# EAGLE design de0-orpsoc (EAGLE 6.5.0)
Assembly variants: no-eth
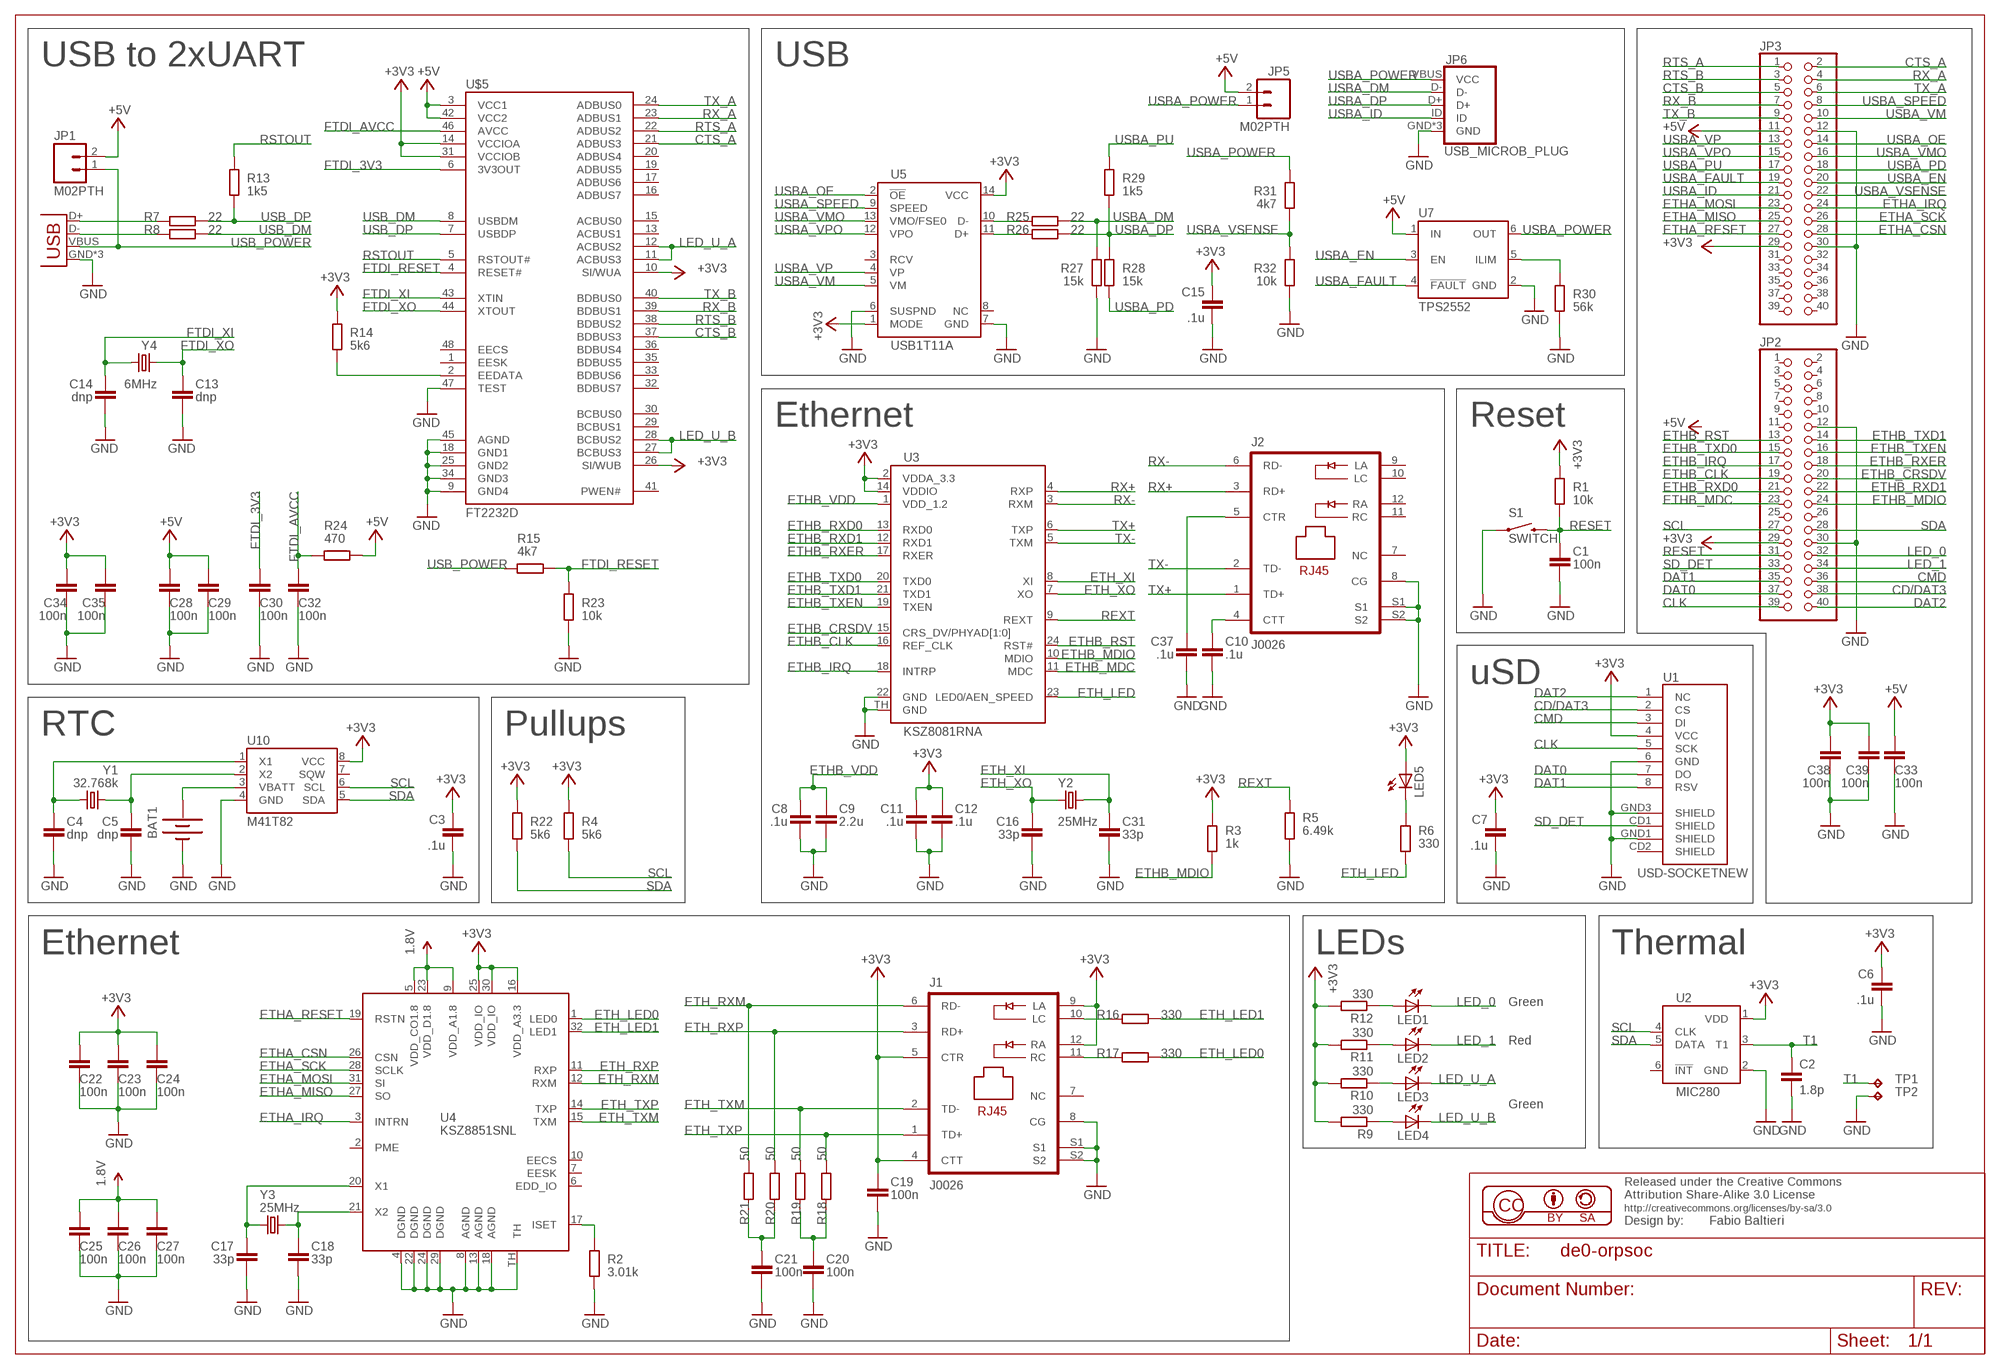
[diagram p0: schematic, sheet 1]

## Parts
BAT1  BATTERY12PTH  [BATTCON_12MM_PTH]
C1  100n  C-EUC0603  [C0603]
C2  1.8p  C-EUC0603  [C0603]
C3  .1u  C-EUC0603  [C0603]
C4  dnp  C-EUC0603  [C0603]
C5  dnp  C-EUC0603  [C0603]
C6  .1u  C-EUC0603  [C0603]
C7  .1u  C-EUC0603  [C0603]
C8  .1u  C-EUC0603  [C0603]
C9  2.2u  C-EUC0603  [C0603]
C10  .1u  C-EUC0603  [C0603]
C11  .1u  C-EUC0603  [C0603]
C12  .1u  C-EUC0603  [C0603]
C13  dnp  C-EUC0603  [C0603]
C14  dnp  C-EUC0603  [C0603]
C15  .1u  C-EUC0603  [C0603]
C16  33p  C-EUC0603  [C0603]
C17  33p  C-EUC0603  [C0603]  (not fitted in variant no-eth)
C18  33p  C-EUC0603  [C0603]  (not fitted in variant no-eth)
C19  100n  C-EUC0603  [C0603]  (not fitted in variant no-eth)
C20  100n  C-EUC0603  [C0603]  (not fitted in variant no-eth)
C21  100n  C-EUC0603  [C0603]  (not fitted in variant no-eth)
C22  100n  C-EUC0603  [C0603]  (not fitted in variant no-eth)
C23  100n  C-EUC0603  [C0603]  (not fitted in variant no-eth)
C24  100n  C-EUC0603  [C0603]  (not fitted in variant no-eth)
C25  100n  C-EUC0603  [C0603]  (not fitted in variant no-eth)
C26  100n  C-EUC0603  [C0603]  (not fitted in variant no-eth)
C27  100n  C-EUC0603  [C0603]  (not fitted in variant no-eth)
C28  100n  C-EUC0603  [C0603]  (not fitted in variant no-eth)
C29  100n  C-EUC0603  [C0603]  (not fitted in variant no-eth)
C30  100n  C-EUC0603  [C0603]
C31  33p  C-EUC0603  [C0603]
C32  100n  C-EUC0603  [C0603]
C33  100n  C-EUC0603  [C0603]  (not fitted in variant no-eth)
C34  100n  C-EUC0603  [C0603]  (not fitted in variant no-eth)
C35  100n  C-EUC0603  [C0603]  (not fitted in variant no-eth)
C37  .1u  C-EUC0603  [C0603]
C38  100n  C-EUC0603  [C0603]  (not fitted in variant no-eth)
C39  100n  C-EUC0603  [C0603]  (not fitted in variant no-eth)
J1  J0026  [PJ-J0]  (not fitted in variant no-eth)
J2  J0026  [PJ-J0]
JP1  M02PTH  [1X02]
JP2  PINHD-2X20  [2X20]
JP3  PINHD-2X20  [2X20]
JP5  M02PTH  [1X02]
JP6  USB_MICROB_PLUG  [USB-MICROB]
JP10  USB-MICROB  [USB-MICROB]
LED1  LEDCHIPLED_0805  [CHIPLED_0805]
LED2  LEDCHIPLED_0805  [CHIPLED_0805]
LED3  LEDCHIPLED_0805  [CHIPLED_0805]
LED4  LEDCHIPLED_0805  [CHIPLED_0805]
LED5  LEDCHIPLED_0805  [CHIPLED_0805]
R1  10k  R-EU_R0603  [R0603]
R2  3.01k  R-EU_R0603  [R0603]  (not fitted in variant no-eth)
R3  1k  R-EU_R0603  [R0603]
R4  5k6  R-EU_R0603  [R0603]
R5  6.49k  R-EU_R0603  [R0603]
R6  330  R-EU_R0603  [R0603]
R7  22  R-EU_R0603  [R0603]
R8  22  R-EU_R0603  [R0603]
R9  330  R-EU_R0603  [R0603]
R10  330  R-EU_R0603  [R0603]
R11  330  R-EU_R0603  [R0603]
R12  330  R-EU_R0603  [R0603]
R13  1k5  R-EU_R0603  [R0603]
R14  5k6  R-EU_R0603  [R0603]
R15  4k7  R-EU_R0603  [R0603]
R16  330  R-EU_R0603  [R0603]  (not fitted in variant no-eth)
R17  330  R-EU_R0603  [R0603]  (not fitted in variant no-eth)
R18  50  R-EU_R0603  [R0603]  (not fitted in variant no-eth)
R19  50  R-EU_R0603  [R0603]  (not fitted in variant no-eth)
R20  50  R-EU_R0603  [R0603]  (not fitted in variant no-eth)
R21  50  R-EU_R0603  [R0603]  (not fitted in variant no-eth)
R22  5k6  R-EU_R0603  [R0603]
R23  10k  R-EU_R0603  [R0603]
R24  470  R-EU_R0603  [R0603]
R25  22  R-EU_R0603  [R0603]
R26  22  R-EU_R0603  [R0603]
R27  15k  R-EU_R0603  [R0603]
R28  15k  R-EU_R0603  [R0603]
R29  1k5  R-EU_R0603  [R0603]
R30  56k  R-EU_R0603  [R0603]
R31  4k7  R-EU_R0603  [R0603]
R32  10k  R-EU_R0603  [R0603]
S1  SWITCH  SWITCH-MOMENTARY-2SMD  [TACTILE_SWITCH_SMD]
TP1  TPTP12R  [TP12R]
TP2  TPTP12R  [TP12R]
U1  USD-SOCKETNEW  [MICRO-SD-SOCKET-PP]
U2  MIC280  [SOT23-6L]
U3  KSZ8081RNA  KSZ8081  [QFN24]
U4  KSZ8851SNL  [MLF32-TH]  (not fitted in variant no-eth)
U5  USB1T11A  [SOIC14]
U7  TPS2552  [SOT23-6L]
U10  M41T82  DS1307SO8  [SO08]
U$5  FT2232D  [LQFP-48]
Y1  32.768k  CRYSTAL32-SMD  [CRYSTAL-32KHZ-SMD]
Y2  25MHz  CRYSTAL5X3  [CRYSTAL-SMD-5X3]
Y3  25MHz  CRYSTAL5X3  [CRYSTAL-SMD-5X3]  (not fitted in variant no-eth)
Y4  6MHz  CRYSTAL5X3  [CRYSTAL-SMD-5X3]

## Nets
1.8V [power]: C25.1 C26.1 C27.1 U4.5(VDD_CO1.8) U4.9(VDD_A1.8) U4.23(VDD_D1.8)
+3V3 [power]: C3.1 C6.1 C7.1 C11.1 C12.1 C15.1 C19.1 C22.1 C23.1 C24.1 C34.1 C35.1 C38.1 C39.1 J1.4(CTT) J1.5(CTR) J1.9(LA) J1.12(RA) JP2.29 JP3.29 LED5.A R1.2 R3.2 R4.1 R9.2 R10.2 R11.2 R12.2 R14.1 R22.1 U1.4(VCC) U2.1(VDD) U3.2(VDDA_3.3) U3.14(VDDIO) U4.16(VDD_A3.3) U4.25(VDD_IO) U4.30(VDD_IO) U5.1(MODE) U5.14(VCC) U10.8(VCC) U$5.10(SI/WUA) U$5.14(VCCIOA) U$5.26(SI/WUB) U$5.31(VCCIOB)
+5V: C28.1 C29.1 C33.1 JP1.2 JP3.11 JP5.2 R24.2 U7.1(IN) U$5.3(VCC1) U$5.42(VCC2)
CD/DAT3: JP2.38 U1.2(CS)
CLK: JP2.39 U1.5(SCK)
CMD: JP2.36 U1.3(DI)
CTS_A: JP3.2 U$5.21(ADBUS3)
CTS_B: JP3.5 U$5.37(BDBUS3)
DAT0: JP2.37 U1.7(DO)
DAT1: JP2.35 U1.8(RSV)
DAT2: JP2.40 U1.1(NC)
ETH_LED: R6.1 U3.23(LED0/AEN_SPEED)
ETH_LED0: R17.2 U4.1(LED0)
ETH_LED1: R16.2 U4.32(LED1)
ETH_RXM: J1.6(RD-) R21.2 U4.12(RXM)
ETH_RXP: J1.3(RD+) R20.2 U4.11(RXP)
ETH_TXM: J1.2(TD-) R19.2 U4.15(TXM)
ETH_TXP: J1.1(TD+) R18.2 U4.14(TXP)
ETH_XI: C31.1 U3.8(XI) Y2.3
ETH_XO: C16.1 U3.7(XO) Y2.1
ETHA_CSN: JP3.28 U4.26(CSN)
ETHA_IRQ: JP3.24 U4.3(INTRN)
ETHA_MISO: JP3.25 U4.27(SO)
ETHA_MOSI: JP3.23 U4.31(SI)
ETHA_RESET: JP3.27 U4.19(RSTN)
ETHA_SCK: JP3.26 U4.28(SCLK)
ETHB_CLK: JP2.19 U3.16(REF_CLK)
ETHB_CRSDV: JP2.20 U3.15(CRS_DV/PHYAD[1:0])
ETHB_IRQ: JP2.17 U3.18(INTRP)
ETHB_MDC: JP2.23 U3.11(MDC)
ETHB_MDIO: JP2.24 R3.1 U3.10(MDIO)
ETHB_RST: JP2.13 U3.24(RST#)
ETHB_RXD0: JP2.21 U3.13(RXD0)
ETHB_RXD1: JP2.22 U3.12(RXD1)
ETHB_RXER: JP2.18 U3.17(RXER)
ETHB_TXD0: JP2.15 U3.20(TXD0)
ETHB_TXD1: JP2.14 U3.21(TXD1)
ETHB_TXEN: JP2.16 U3.19(TXEN)
ETHB_VDD: C8.1 C9.1 U3.1(VDD_1.2)
FTDI_3V3: C30.1 U$5.6(3V3OUT)
FTDI_AVCC: C32.1 R24.1 U$5.46(AVCC)
FTDI_RESET: R15.2 R23.1 U$5.4(RESET#)
FTDI_XI: C14.1 U$5.43(XTIN) Y4.3
FTDI_XO: C13.1 U$5.44(XTOUT) Y4.1
GND: BAT1.GND(-) C1.2 C2.2 C3.2 C4.2 C5.2 C6.2 C7.2 C8.2 C9.2 C10.2 C11.2 C12.2 C13.2 C14.2 C15.2 C16.2 C17.2 C18.2 C19.2 C20.2 C21.2 C22.2 C23.2 C24.2 C25.2 C26.2 C27.2 C28.2 C29.2 C30.2 C31.2 C32.2 C33.2 C34.2 C35.2 C37.2 C38.2 C39.2 J1.8(CG) J1.S1 J1.S2 J2.8(CG) J2.S1 J2.S2 JP2.12 JP2.30 JP3.12 JP3.30 JP6.GND JP6.MT1(GND) JP6.MT2(GND) JP10.GND JP10.MT1(GND) JP10.MT2(GND) R2.2 R5.1 R23.2 R27.2 R30.2 R32.2 S1.1 TP2.TP U1.6(GND) U1.GND1(SHIELD) U1.GND3(SHIELD) U2.2(GND) U3.22(GND) U3.TH(GND) U4.4(DGND) U4.8(AGND) U4.13(AGND) U4.18(AGND) U4.22(DGND) U4.24(DGND) U4.29(DGND) U4.TH U5.6(SUSPND) U5.7(GND) U7.2(GND) U10.4(GND) U$5.9(GND4) U$5.18(GND1) U$5.25(GND2) U$5.34(GND3) U$5.45(AGND) U$5.47(TEST)
LED_0: JP2.32 LED1.C
LED_1: JP2.34 LED2.C
LED_U_A: LED3.C U$5.11(ACBUS3) U$5.12(ACBUS2)
LED_U_B: LED4.C U$5.27(BCBUS3) U$5.28(BCBUS2)
N$1: LED3.A R10.1
N$2: LED4.A R9.1
N$3: C5.1 U10.2(X2) Y1.X1
N$4: BAT1.VCC@1(+) U10.3(VBATT)
N$5: C4.1 U10.1(X1) Y1.X2
N$6: LED5.C R6.2
N$9: JP10.D- R8.1
N$10: C10.1 J2.4(CTT)
N$11: C37.1 J2.5(CTR)
N$12: R25.1 U5.10(D-)
N$13: JP10.D+ R7.1
N$14: R26.1 U5.11(D+)
N$15: R14.2 U$5.2(EEDATA)
N$16: R30.1 U7.5(ILIM)
N$18: LED1.A R12.1
N$19: LED2.A R11.1
N$20: J1.10(LC) R16.1
N$21: J1.11(RC) R17.1
N$22: R2.1 U4.17(ISET)
N$23: C17.1 U4.20(X1) Y3.1
N$24: C18.1 U4.21(X2) Y3.3
N$26: C21.1 R20.1 R21.1
N$27: C20.1 R18.1 R19.1
RESET: C1.1 JP2.31 R1.1 S1.3
REXT: R5.2 U3.9(REXT)
RSTOUT: R13.1 U$5.5(RSTOUT#)
RTS_A: JP3.1 U$5.22(ADBUS2)
RTS_B: JP3.3 U$5.38(BDBUS2)
RX+: J2.3(RD+) U3.4(RXP)
RX-: J2.6(RD-) U3.3(RXM)
RX_A: JP3.4 U$5.23(ADBUS1)
RX_B: JP3.7 U$5.39(BDBUS1)
SCL: JP2.27 R4.2 U2.4(CLK) U10.6(SCL)
SD_DET: JP2.33 U1.CD1(SHIELD)
SDA: JP2.28 R22.2 U2.5(DATA) U10.5(SDA)
T1: C2.1 TP1.TP U2.3(T1)
TX+: J2.1(TD+) U3.6(TXP)
TX-: J2.2(TD-) U3.5(TXM)
TX_A: JP3.6 U$5.24(ADBUS0)
TX_B: JP3.9 U$5.40(BDBUS0)
USB_DM: R8.2 U$5.8(USBDM)
USB_DP: R7.2 R13.2 U$5.7(USBDP)
USB_POWER: JP1.1 JP10.VBUS R15.1
USBA_DM: JP6.D- R25.2 R27.1
USBA_DP: JP6.D+ R26.2 R28.1 R29.2
USBA_EN: JP3.20 U7.3(EN)
USBA_FAULT: JP3.19 U7.4(!FAULT)
USBA_ID: JP3.21 JP6.ID
USBA_OE: JP3.14 U5.2(!OE)
USBA_PD: JP3.18 R28.2
USBA_POWER: JP5.1 JP6.VBUS(VCC) R31.1 U7.6(OUT)
USBA_PU: JP3.17 R29.1
USBA_SPEED: JP3.8 U5.9(SPEED)
USBA_VM: JP3.10 U5.5(VM)
USBA_VMO: JP3.16 U5.13(VMO/FSE0)
USBA_VP: JP3.13 U5.4(VP)
USBA_VPO: JP3.15 U5.12(VPO)
USBA_VSENSE: JP3.22 R31.2 R32.1
Unconnected: J1.7(NC) J2.7(NC) J2.9(LA) J2.10(LC) J2.11(RC) J2.12(RA) JP2.1 JP2.2 JP2.3 JP2.4 JP2.5 JP2.6 JP2.7 JP2.8 JP2.9 JP2.10 JP2.11 JP2.25 JP2.26 JP3.31 JP3.32 JP3.33 JP3.34 JP3.35 JP3.36 JP3.37 JP3.38 JP3.39 JP3.40 U1.CD2(SHIELD) U2.6(!INT) U4.2(PME) U4.6(EDD_IO) U4.7(EESK) U4.10(EECS) U5.3(RCV) U5.8(NC) U10.7(SQW) U$5.1(EESK) U$5.13(ACBUS1) U$5.15(ACBUS0) U$5.16(ADBUS7) U$5.17(ADBUS6) U$5.19(ADBUS5) U$5.20(ADBUS4) U$5.29(BCBUS1) U$5.30(BCBUS0) U$5.32(BDBUS7) U$5.33(BDBUS6) U$5.35(BDBUS5) U$5.36(BDBUS4) U$5.41(PWEN#) U$5.48(EECS)

## Notes on the sheet
- USB to 2xUART | USB
- Ethernet | Reset
- uSD
- RTC | Pullups
- Ethernet | LEDs | Thermal
- Green
- Red
- Green

## Library data of the parts
BAT1 = SparkFun-Electromechanical:BATTERY: Battery Holders Various common sizes : AA, AAA, 20mm coin cell and 12mm coin cell. 20MM_4LEGS, BATT-10373
C1-C35 C37-C39 = rcl:C-EU: CAPACITOR, European symbol
J1 J2 = micrel:J0026: RJ45 PulseJack w/LEDs
JP1 JP5 = SparkFun-Connectors:M02: Standard 2-pin 0.1" header. Use with - straight break away headers ( PRT-00116) - right angle break away headers (PRT-00553) - swiss pins (PRT-00743) - machine pins (PRT-00117) - female headers (PRT-00115) Molex polarized connector foot print use with: PRT-08233 with associated crimp pins and housings. 2.54_SCREWTERM for use with PRT-10571. 3.5mm Screw Terminal footprints for PRT-08084 5mm Screw Terminal footprints for use with PRT-08433
JP2 JP3 = pinhead:PINHD-2X20: PIN HEADER
JP6 = SparkFun-Connectors:USB_MICROB_PLUG: USB Micro-B Plug Comes in a variety of packages. Check out Hirose's ZX-x0 line: http://www.hirose.co.jp/cataloge_hp/e24200011.pdf
JP10 = SparkFun-Connectors:USB: USB Connectors USB-B-PTH is fully proven SKU : PRT-00139/CONN-08278 USB-miniB is fully proven SKU : PRT-00587 USB-A-PCB is untested. USB-A-H is throughly reviewed, but untested. Spark Fun Electronics SKU : PRT-00437 USB-B-SMT is throughly reviewed, but untested. Needs silkscreen touching up. USB-A-S has not been used/tested USB-MB-H has not been used/tested USB-MICROB has been used. CONN-09505; PROD_ID: CONN-09505
LED1-LED5 = led:LED: LED OSRAM: - CHIPLED LG R971, LG N971, LY N971, LG Q971, LY Q971, LO R971, LY R971 LH N974, LH R974 LS Q976, LO Q976, LY Q976 LO Q996 - Hyper CHIPLED LW Q18S LB Q993, LB Q99A, LB R99A - SideLED LS A670, LO A670, LY A670, LG A670, LP A670 LB A673, LV A673, LT A673, LW A673 LH A674 LY A675 LS A676, LA A676, LO A676, LY A676, LW A676 LS A679, LY A679, LG A679 - Hyper Micro SIDELED® LS Y876, LA Y876, LO Y876, LY Y876 LT Y87S - SmartLED LW L88C, LW L88S LB L89C, LB L89S, LG L890 LS L89K, LO L89K, LY L89K LS L896, LA L896, LO L896, LY L896 - TOPLED LS T670, LO T670, LY T670, LG T670, LP T670 LSG T670, LSP T670, LSY T670, LOP T670, LYG T670 LG T671, LOG T671, LSG T671 LB T673, LV T673, LT T673, LW T673 LH T674 LS T676, LA T676, LO T676, LY T676, LB T676, LH T676, LSB T676, LW T676 LB T67C, LV T67C, LT T67C, LS T67K, LO T67K, LY T67K, LW E67C LS E67B, LA E67B, LO E67B, LY E67B, LB E67C, LV E67C, LT E67C LW T67C LS T679, LY T679, LG T679 LS T770, LO T770, LY T770, LG T770, LP T770 LB T773, LV T773, LT T773, LW T773 LH T774 LS E675, LA E675, LY E675, LS T675 LS T776, LA T776, LO T776, LY T776, LB T776 LHGB T686 LT T68C, LB T68C - Hyper Mini TOPLED® LB M676 - Mini TOPLED Santana® LG M470 LS M47K, LO M47K, LY M47K Source: http://www.osram.convergy.de LUXEON: - LUMILED® LXK2-PW12-R00, LXK2-PW12-S00, LXK2-PW14-U00, LXK2-PW14-V00 LXK2-PM12-R00, LXK2-PM12-S00, LXK2-PM14-U00 LXK2-PE12-Q00, LXK2-PE12-R00, LXK2-PE12-S00, LXK2-PE14-T00, LXK2-PE14-U00 LXK2-PB12-K00, LXK2-PB12-L00, LXK2-PB12-M00, LXK2-PB14-N00, LXK2-PB14-P00, LXK2-PB14-Q00 LXK2-PR12-L00, LXK2-PR12-M00, LXK2-PR14-Q00, LXK2-PR14-R00 LXK2-PD12-Q00, LXK2-PD12-R00, LXK2-PD12-S00 LXK2-PH12-R00, LXK2-PH12-S00 LXK2-PL12-P00, LXK2-PL12-Q00, LXK2-PL12-R00 Source: www.luxeon.com KINGBRIGHT: KA-3528ASYC Source: www.kingbright.com
R1-R32 = rcl:R-EU_: RESISTOR, European symbol
S1 = SparkFun-Electromechanical:SWITCH-MOMENTARY-2: Various NO switches- pushbuttons, reed, etc
TP1 TP2 = testpad:TP: Test pad
U1 = SparkFun-Connectors:USD-SOCKET: microSD Socket Push-push type uSD socket. Schematic element and footprint production proven. Spark Fun Electronics SKU : PRT-00127. tDoc lines correctly indicate media card edge positions when inserting (unlocked, locked, depressed).
U2 = balto:MIC280: MIC280 Precision IttyBitty Thermal Supervisor
U3 = balto:KSZ8081: KSZ8081RNA/KSZ8081RND 10Base-T/100Base-TX PHY with RMII Support
U4 = balto:KSZ8851SNL: KSZ8851SNL/SNLI
U5 = balto:USB1T11A: USB1T11A - USB Transceiver
U7 = balto:TPS2552: Precision adjustable current limited power distribution switch
U10 = SparkFun-FreqCtrl:DS1307: I2C real-time clock with battery backup.
U$5 = SparkFun-DigitalIC:FT2232D: USB to USART/FIFO/JTAG/SPI/I2C
Y1 = SparkFun-FreqCtrl:CRYSTAL: Various standard crystals. Proven footprints. Spark Fun Electronics SKU : COM-00534
Y2-Y4 = SparkFun:CRYSTAL: Crystals Various standard crystals. Proven footprints. Spark Fun Electronics SKU : COM-00534

## Net classes
1 power: width 0.203 mm

## Board
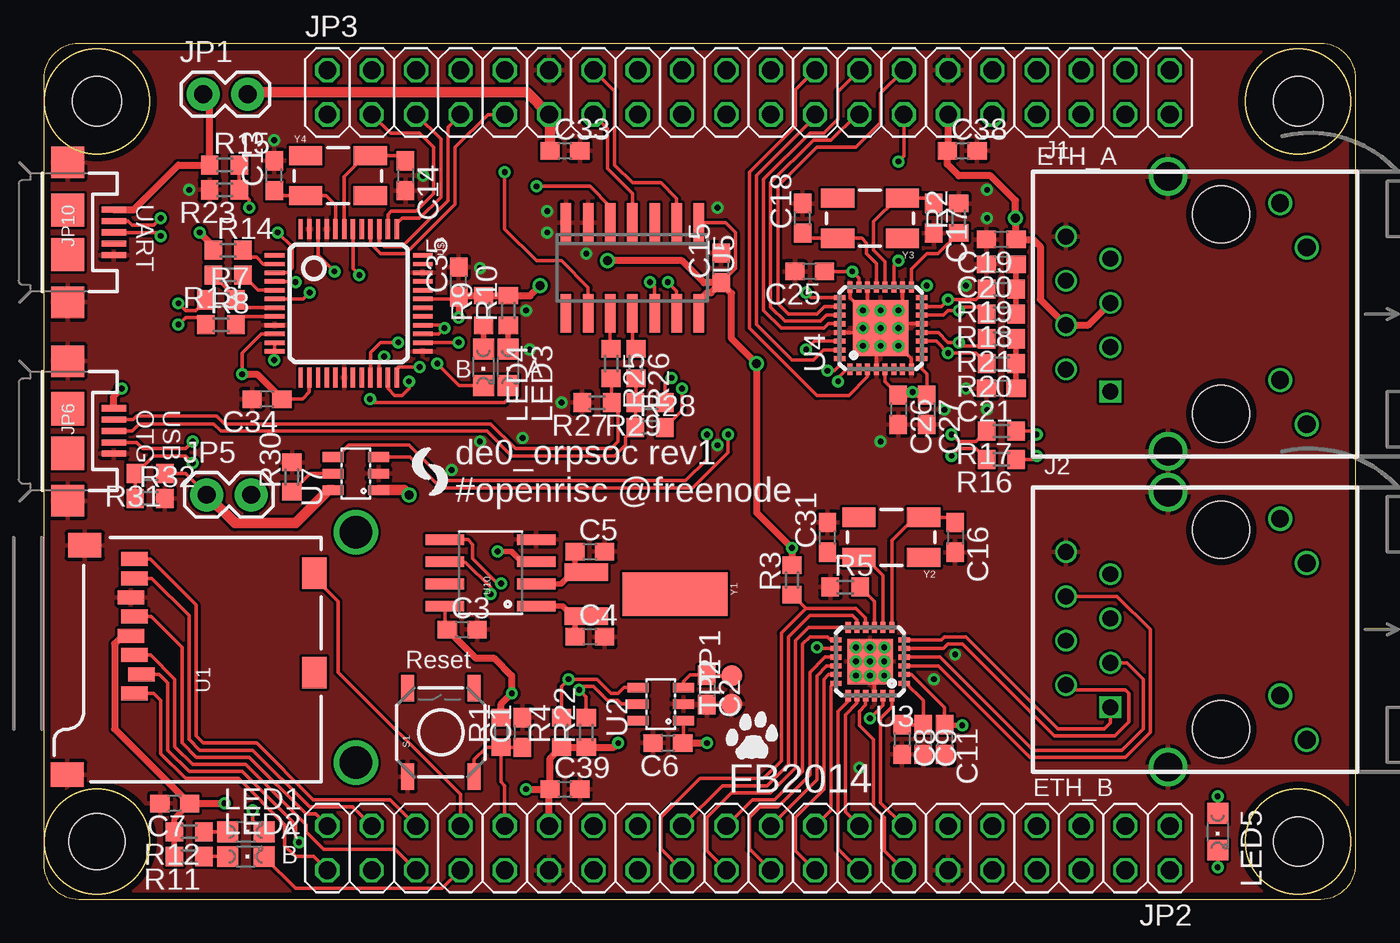
[diagram p1: board, top side]
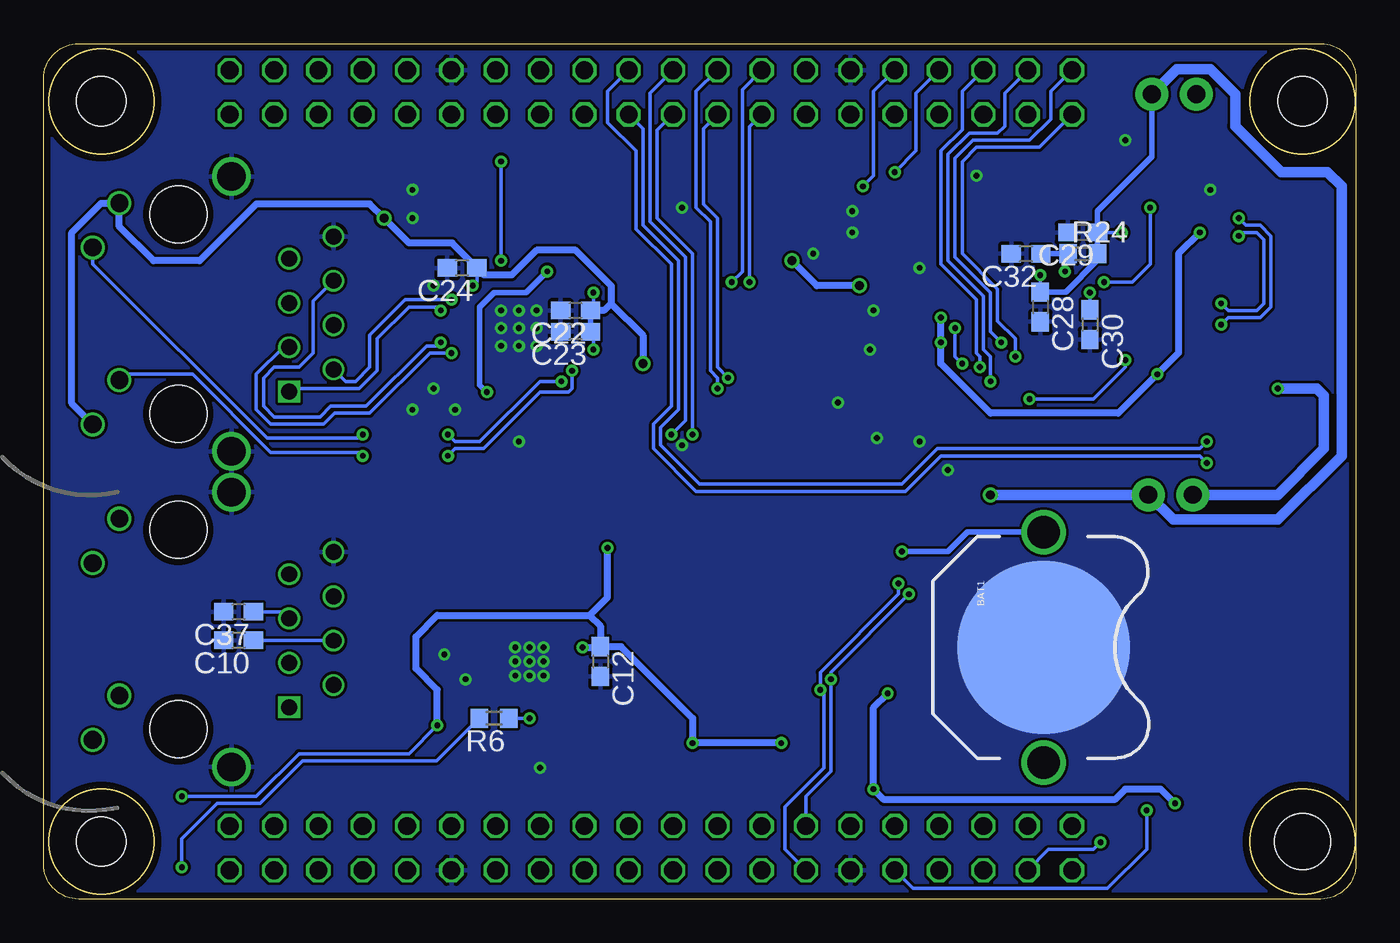
[diagram p2: board, bottom side, seen from below]

Size 75.18 x 49.02 mm. Coordinates in mm from the lower left corner, seen from the top.
Outline: 0,47.02 0,2 arc90 2,0 73.18,0 arc90 75.18,2 75.18,47.02 arc90 73.18,49.02 2,49.02 arc90 0,47.02
Outline: circle at 3.05,3.3 radius 3
Outline: circle at 71.88,3.3 radius 3
Outline: circle at 71.88,45.72 radius 3
Outline: circle at 3.05,45.72 radius 3
Copper layers (1*16): Top 0.035mm / dielectric 1.5mm / Bottom 0.035mm
Design rules "balto *": minimum track width 6mil, minimum drill 13mil, track to track 6mil, track to pad 6mil, pad to pad 6mil, via to via 6mil, smd to smd 6mil, copper to edge 15mil, drill to drill 6mil, minimum pad ring 6mil, minimum via ring 7mil, stop-mask expansion 2mil, vias tented up to drill 20mil, thermal gap 8mil
Holes 3.2 mm at 3.05,3.3
Holes 2.8 mm at 71.88,3.3 71.88,45.72 3.05,45.72

### Footprints (pad centres in the part's own frame; a part is rotated, then mirrored left to right if it is on the bottom)
BATTCON_12MM_PTH = smd 9.906 x 9.906: GND 0,0 | drill 1.854 pad 2.54: VCC@1 -6.604,0; VCC@2 6.604,0
C0603 = smd 1.1 x 1: 1 -0.85,0; 2 0.85,0
PJ-J0 = drill 0.914 square: 1 4.445,-6.35 | drill 0.914: 2 3.175,-8.89; 3 1.905,-6.35; 4 0.635,-8.89; 5 -0.635,-6.35; 6 -1.905,-8.89; 7 -3.175,-6.35; 8 -4.445,-8.89 | drill 1.016: 9 6.325,4.902; 10 3.785,3.378; 11 -3.81,4.902; 12 -6.35,3.378 | drill 1.626: S1 -7.874,-3.048; S2 7.874,-3.048 | hole 3.251: -5.715,0; 5.715,0
1X02 = drill 1.016 pad 1.88: 1 0,0; 2 2.54,0
2X20 = drill 1.016 octagon: 1 -24.13,-1.27; 2 -24.13,1.27; 3 -21.59,-1.27; 4 -21.59,1.27; 5 -19.05,-1.27; 6 -19.05,1.27; 7 -16.51,-1.27; 8 -16.51,1.27; 9 -13.97,-1.27; 10 -13.97,1.27; 11 -11.43,-1.27; 12 -11.43,1.27; 13 -8.89,-1.27; 14 -8.89,1.27; 15 -6.35,-1.27; 16 -6.35,1.27; 17 -3.81,-1.27; 18 -3.81,1.27; 19 -1.27,-1.27; 20 -1.27,1.27; 21 1.27,-1.27; 22 1.27,1.27; 23 3.81,-1.27; 24 3.81,1.27; 25 6.35,-1.27; 26 6.35,1.27; 27 8.89,-1.27; 28 8.89,1.27; 29 11.43,-1.27; 30 11.43,1.27; 31 13.97,-1.27; 32 13.97,1.27; 33 16.51,-1.27; 34 16.51,1.27; 35 19.05,-1.27; 36 19.05,1.27; 37 21.59,-1.27; 38 21.59,1.27; 39 24.13,-1.27; 40 24.13,1.27
USB-MICROB = smd 0.35 x 1.4: D+ 0,2.65; D- -0.65,2.65; GND 1.3,2.65; ID 0.65,2.65; VBUS -1.3,2.65 | smd 1.8 x 1.9: MT1 -4,0; MT2 4,0 | smd 1.9 x 1.9: P$1 -1.27,0; P$2 1.27,0
CHIPLED_0805 = smd 1.2 x 1.2: A 0,-1.05; C 0,1.05
R0603 = smd 1 x 1.1: 1 -0.85,0; 2 0.85,0
TACTILE_SWITCH_SMD = smd 1.524 x 0.762: 1 -2.54,1.905; 2 2.54,1.905; 3 -2.54,-1.905; 4 2.54,-1.905
TP12R = smd 1.2 x 1.2: TP 0,0
MICRO-SD-SOCKET-PP = smd 0.8 x 1.5: 1 -8.94,10.7; 2 -7.84,10.3; 3 -6.74,10.7; 4 -5.64,10.9; 5 -4.54,10.7; 6 -3.44,10.9; 7 -2.34,10.7; 8 -1.24,10.7 | smd 1.8 x 1.4: CD1 -2.05,0.4; CD2 -7.75,0.4 | smd 1.4 x 1.9: GND1 -13.6,14.55; GND3 -0.45,13.55
SOT23-6L = smd 0.55 x 1.2: 1 -0.95,-1.3; 2 0,-1.3; 3 0.95,-1.3; 4 0.95,1.3; 5 0,1.3; 6 -0.95,1.3
QFN24 = smd 0.65 x 0.29: 1 -1.95,1.25; 2 -1.95,0.75; 3 -1.95,0.25; 4 -1.95,-0.25; 5 -1.95,-0.75; 6 -1.95,-1.25; 13 1.95,-1.25; 14 1.95,-0.75; 15 1.95,-0.25; 16 1.95,0.25; 17 1.95,0.75; 18 1.95,1.25 | smd 0.29 x 0.65: 7 -1.25,-1.95; 8 -0.75,-1.95; 9 -0.25,-1.95; 10 0.25,-1.95; 11 0.75,-1.95; 12 1.25,-1.95; 19 1.25,1.95; 20 0.75,1.95; 21 0.25,1.95; 22 -0.25,1.95; 23 -0.75,1.95; 24 -1.25,1.95 | smd 2.6 x 2.6: TH 0,0
MLF32-TH = smd 0.65 x 0.29: 1 -2.35,1.75; 2 -2.35,1.25; 3 -2.35,0.75; 4 -2.35,0.25; 5 -2.35,-0.25; 6 -2.35,-0.75; 7 -2.35,-1.25; 8 -2.35,-1.75; 17 2.35,-1.75; 18 2.35,-1.25; 19 2.35,-0.75; 20 2.35,-0.25; 21 2.35,0.25; 22 2.35,0.75; 23 2.35,1.25; 24 2.35,1.75 | smd 0.29 x 0.65: 9 -1.75,-2.35; 10 -1.25,-2.35; 11 -0.75,-2.35; 12 -0.25,-2.35; 13 0.25,-2.35; 14 0.75,-2.35; 15 1.25,-2.35; 16 1.75,-2.35; 25 1.75,2.35; 26 1.25,2.35; 27 0.75,2.35; 28 0.25,2.35; 29 -0.25,2.35; 30 -0.75,2.35; 31 -1.25,2.35; 32 -1.75,2.35 | smd 3.2 x 3.2: TH 0,0
SOIC14 = smd 0.6 x 2.2: 1 -3.81,-2.6; 2 -2.54,-2.6; 3 -1.27,-2.6; 4 0,-2.6; 5 1.27,-2.6; 6 2.54,-2.6; 7 3.81,-2.6; 8 3.81,2.6; 9 2.54,2.6; 10 1.27,2.6; 11 0,2.6; 12 -1.27,2.6; 13 -2.54,2.6; 14 -3.81,2.6
SO08 = smd 0.61 x 2.21: 1 -1.905,-2.616; 2 -0.635,-2.616; 3 0.635,-2.616; 4 1.905,-2.616; 5 1.905,2.616; 6 0.635,2.616; 7 -0.635,2.616; 8 -1.905,2.616
LQFP-48 = smd 0.254 x 1.143: 1 -2.75,-4.25; 2 -2.25,-4.25; 3 -1.75,-4.25; 4 -1.25,-4.25; 5 -0.75,-4.25; 6 -0.25,-4.25; 7 0.25,-4.25; 8 0.75,-4.25; 9 1.25,-4.25; 10 1.75,-4.25; 11 2.25,-4.25; 12 2.75,-4.25; 25 2.75,4.25; 26 2.25,4.25; 27 1.75,4.25; 28 1.25,4.25; 29 0.75,4.25; 30 0.25,4.25; 31 -0.25,4.25; 32 -0.75,4.25; 33 -1.25,4.25; 34 -1.75,4.25; 35 -2.25,4.25; 36 -2.75,4.25 | smd 1.143 x 0.254: 13 4.25,-2.75; 14 4.25,-2.25; 15 4.25,-1.75; 16 4.25,-1.25; 17 4.25,-0.75; 18 4.25,-0.25; 19 4.25,0.25; 20 4.25,0.75; 21 4.25,1.25; 22 4.25,1.75; 23 4.25,2.25; 24 4.25,2.75; 37 -4.25,2.75; 38 -4.25,2.25; 39 -4.25,1.75; 40 -4.25,1.25; 41 -4.25,0.75; 42 -4.25,0.25; 43 -4.25,-0.25; 44 -4.25,-0.75; 45 -4.25,-1.25; 46 -4.25,-1.75; 47 -4.25,-2.25; 48 -4.25,-2.75
CRYSTAL-32KHZ-SMD = smd 2.5 x 6: SHEILD 0,5.08 | smd 1 x 2.5: X1 -1.27,0; X2 1.27,0
CRYSTAL-SMD-5X3 = smd 1.9 x 1.1: 1 -1.85,-1.15; 2 1.85,-1.15; 3 1.85,1.15; 4 -1.85,1.15

### Placement (x,y rotation side)
BAT1  17.88,14.43 270 bottom
C1  27.43,9.55 90 top
C2  38,11.99 270 top
C3  23.98,15.44 0 top
C4  31.29,15.04 0 top
C5  31.29,19.91 0 top
C6  35.76,8.94 180 top
C7  7.52,5.49 180 top
C8  49.17,9.14 270 top
C9  50.39,9.14 270 top
C10  64.01,14.83 180 bottom
C11  51.61,9.14 270 top
C12  43.28,13.61 270 bottom
C13  13.21,41.45 90 top
C14  20.73,41.45 270 top
C15  38.81,36.17 90 top
C16  52.22,20.73 270 top
C17  51,39.01 270 top
C18  43.48,39.01 90 top
C19  54.86,37.8 180 top
C20  54.86,36.37 180 top
C21  54.86,29.26 180 top
C22  44.7,33.73 180 bottom
C23  44.7,32.51 180 bottom
C24  51.21,36.17 180 bottom
C25  43.89,35.97 180 top
C26  48.97,28.04 270 top
C27  50.6,28.04 270 top
C28  18.08,33.93 270 bottom
C29  15.65,38.2 180 bottom
C30  15.24,32.92 270 bottom
C31  44.91,20.73 90 top
C32  18.9,36.98 180 bottom
C33  29.87,42.88 0 top
C34  12.8,28.65 180 top
C35  23.77,35.36 90 top
C37  64.01,16.46 180 bottom
C38  52.63,42.88 0 top
C39  29.87,6.3 0 top
J1  67.46,33.53 270 top
J2  67.46,15.44 270 top
JP1  9.14,46.13 0 top
JP2  40.39,2.92 180 top
JP3  40.39,46.23 0 top
JP5  9.35,23.16 0 top
JP6  1.37,26.82 270 top
JP10  1.37,38.2 270 top
LED1  11.58,3.86 270 top
LED2  11.58,2.44 270 top
LED3  26.62,30.48 180 top
LED4  25.2,30.48 180 top
LED5  67.26,3.86 180 top
R1  26.21,9.55 90 top
R2  52.43,39.01 90 top
R3  42.88,18.29 90 top
R4  29.67,9.55 90 top
R5  45.92,17.88 0 top
R6  49.38,10.36 180 bottom
R7  10.16,34.34 0 top
R8  10.16,32.92 0 top
R9  25.2,33.73 90 top
R10  26.62,33.73 90 top
R11  8.33,2.44 180 top
R12  8.33,3.86 180 top
R13  10.57,35.76 180 top
R14  10.57,37.19 0 top
R15  10.36,42.06 0 top
R16  54.86,25.2 180 top
R17  54.86,26.82 180 top
R18  54.86,33.53 180 top
R19  54.86,34.95 180 top
R20  54.86,30.68 180 top
R21  54.86,32.11 180 top
R22  31.09,9.55 90 top
R23  10.36,40.64 180 top
R24  15.65,36.98 0 bottom
R25  32.51,30.68 270 top
R26  33.93,30.68 270 top
R27  31.7,28.45 180 top
R28  34.75,27.03 0 top
R29  34.75,28.45 180 top
R30  14.22,24.18 90 top
R31  6.1,24.38 180 top
R32  6.1,22.96 0 top
S1  22.76,9.55 90 top
TP1  39.42,12.8 90 top
TP2  39.42,11.18 90 top
U1  15.9,20.73 90 top
U2  35.36,11.18 90 top
U3  47.35,13.61 180 top
U4  47.96,32.72 90 top
U5  33.73,36.17 180 top
U7  17.88,24.38 90 top
U10  25.6,18.69 90 top
U$1  [CAT-L]  40.64,8.94 0 top
U$4  [CS]  22.15,24.38 0 top
U$5  17.48,34.14 270 top
Y1  31.09,17.48 270 top
Y2  48.56,20.73 180 top
Y3  47.35,39.01 180 top
Y4  16.87,41.45 0 top

### Tracks (layer width: path | path; a pad name or v marks a point on that pad's centre or on a via)
1.8V  (via drill 0.33)
  Top 0.203: U4.23 46.7,35.59 v46.33,35.97 C25.1 | U4.5 48.2,29.66 C26.1 | U4.9 50.3,30.36 50.6,30.07 C27.1
  Top 0.305: C26.1 49.62,28.89 v49.78,29.06 49.95,28.89 C27.1
  Bottom 0.305: v46.33,35.97 47.55,34.75 49.38,34.75 50.19,33.93 50.19,29.46 v49.78,29.06
+3V3  (via drill 0.33, 0.33 pad 0.3, 0.51)
  Top 0.203: U$5.10 12.47,32.39 11.38,31.29 v11.38,30.07 | U$5.14 15.22,29.04 14.83,28.65 C34.1 | U$5.31 23.66,34.39 C35.1 | U$5.26 23.76,31.89 v23.77,31.9 | U5.1 39.06,38.77 39.62,38.2 39.62,36.13 C15.1 | U4.25 43.97,34.47 v43.69,34.75 | U4.30 44.16,31.96 v43.69,31.5 | U4.16 50.3,34.86 v50.6,35.15 | U3.14 44.36,14.36 v44.3,14.43 | U3.2 49.72,12.86 51.61,10.97 C11.1 | LED5.A v67.26,5.89 | U2.1 36.66,8.98 C6.1 | U10.8 22.99,15.58 C3.1
  Top 0.305: R14.1 9.72,37.43 | v23.77,33.33 C35.1 23.85,34.58 | 55.68,37.83 C19.1 | U5.14 37.54,34.29 | 51.82,42.92 C38.1 | R11.2 R12.2 7.48,4.6 C7.1 8.33,5.49 | U1.4 4.52,15.09 | 28.96,6.24 C39.1 | C11.1 51.65,9.96 v52.63,9.96
  Top 0.406: 9.72,37.43 v8.94,38.2 | 23.85,34.58 R9.2 R10.2 27.88,34.58 v28.45,35.15 | v11.38,30.07 12.23,30.07 C34.1 | C15.1 37.83,35.32 36.58,36.58 v32.31,36.58 | 55.68,37.83 v55.68,39.01 55.68,40.03 54.25,41.45 52.43,41.45 51.78,42.1 C38.1 | 37.54,34.29 38,34.75 38.24,34.75 C15.1 | JP3.29 51.82,42.92 | C19.1 56.69,37.8 57.1,37.39 57.1,34.37 J1.4 59.84,32.89 J1.5 | C15.1 39.42,34.71 39.42,32.11 v40.84,30.68 40.84,22.15 v42.88,20.12 R3.2 | 4.52,15.09 4.06,14.63 4.06,9.75 8.33,5.49 | C7.1 v10.36,5.49 | v27.64,6.3 C39.1 29.02,8.05 R4.1 R22.1 32.68,8.7 v32.92,8.94 | JP2.29 28.96,6.24 | R1.2 26.21,11.18 v26.82,11.79 26.82,12.8 25.81,13.82 24.75,13.82 C3.1 | C6.1 v38,8.94
  Bottom 0.203: v43.69,31.5 43.69,32.35 C23.1 | v43.69,34.75 43.69,33.9 C22.1 | v50.6,35.15 50.36,35.39 C24.1 | v67.26,5.89 62.99,5.89 60.55,8.33 54.25,8.33 v52.63,9.96
  Bottom 0.305: C23.1 C22.1 | 43.32,14.43 C12.1
  Bottom 0.406: v8.94,38.2 10.16,36.98 10.16,31.29 v11.38,30.07 13.61,27.84 20.93,27.84 23.77,30.68 v23.77,31.9 v23.77,33.33 | v28.45,35.15 30.89,35.15 v32.31,36.58 | 42.67,34.14 42.67,35.15 44.7,37.19 46.94,37.19 48.36,35.76 49.95,35.76 C24.1 51.78,37.59 54.25,37.59 v55.68,39.01 56.49,39.83 62.99,39.83 66.24,36.58 68.89,36.58 70.84,38.53 J1.12 71.88,39.88 73.56,38.2 73.56,28.4 J1.9 | 42.67,34.14 43.08,33.73 C22.1 | 42.67,34.14 40.84,32.31 v40.84,30.68 | v10.36,5.49 11.18,6.3 13.21,6.3 13.82,5.69 27.03,5.69 v27.64,6.3 27.64,10.97 v26.82,11.79 | v44.3,14.43 43.32,14.43 | v52.63,9.96 52.63,11.99 53.85,13.21 53.85,15.04 52.63,16.26 43.89,16.26 | 43.89,16.26 43.28,15.65 C12.1 42.1,14.46 38,10.36 v38,8.94 v32.92,8.94 | 43.89,16.26 42.88,17.27 v42.88,20.12
+5V  (via drill 0.33, 0.51)
  Top 0.203: U$5.3 13.94,35.89 14.22,36.17 14.22,37.39 v13.41,38.2 | U$5.42 17.73,36.12 v18.09,35.76
  Top 0.61: JP1.2 11.79,46.23 27.69,46.23 JP3.11 29.02,44.9 C33.1 | U7.1 20.66,23.43 v20.93,23.16
  Bottom 0.203: v18.09,35.76 C28.1 | v13.41,38.2 C29.1
  Bottom 0.305: C28.1 16.62,34.78 14.8,36.61 R24.2 C29.1 14.8,39.42 11.68,42.53 JP1.2
  Bottom 0.61: JP1.2 10.26,47.55 8.33,47.55 6.91,46.13 6.91,44.3 4.27,41.66 1.63,41.66 0.81,40.84 0.81,25.4 4.47,21.74 10.46,21.74 JP5.2 v20.93,23.16
CD/DAT3  (via drill 0.33)
  Top 0.203: v14.63,3.25 14.43,3.45 14.43,4.27 11.38,7.32 8.33,7.32 7.11,8.53 7.11,12.39 6.62,12.89 U1.2
  Bottom 0.203: JP2.38 17.61,2.85 15.04,2.85 v14.63,3.25
CLK
  Top 0.203: JP2.39 15.57,4.88 15.04,4.88 11.79,8.13 8.74,8.13 7.92,8.94 7.92,14.43 6.17,16.19 U1.5
CMD
  Top 0.203: JP2.36 20.14,2.85 16.05,2.85 15.04,3.86 15.04,4.27 11.58,7.72 8.53,7.72 7.52,8.74 7.52,12.6 6.13,13.99 U1.3
CTS_A  (via drill 0.33)
  Top 0.203: U$5.21 18.73,31.32 19.3,31.9 v20.32,31.9
  Bottom 0.203: v20.32,31.9 20.93,32.51 20.93,34.75 22.96,36.78 22.96,42.47 21.95,43.48 18.69,43.48 17.48,44.7 17.48,46.28 JP3.2
CTS_B
  Top 0.203: U$5.37 20.23,38.72 20.52,39.01 21.54,39.01 22.76,40.23 22.76,43.54 JP3.5
DAT0
  Top 0.203: JP2.37 17.71,5.28 15.24,5.28 11.99,8.53 8.94,8.53 8.33,9.14 8.33,16.26 6.2,18.39 U1.7
DAT1
  Top 0.203: JP2.35 19.84,5.69 15.44,5.69 12.19,8.94 9.14,8.94 8.74,9.35 8.74,16.87 6.12,19.49 U1.8
DAT2
  Top 0.203: JP2.40 15.47,2.44 14.43,2.44 13.82,3.05 13.82,4.27 11.18,6.91 8.13,6.91 6.71,8.33 6.71,11.38 6.3,11.79 U1.1
ETH_LED  (via drill 0.33)
  Top 0.203: U3.23 48.1,11.11 v47.35,10.36
  Bottom 0.203: v47.35,10.36 R6.1
ETH_LED0  (via drill 0.33)
  Top 0.203: U4.1 46.01,30.36 45.52,29.87 v45.52,29.67 | v52.02,26.62 52.43,26.21 53.4,26.21 R17.2
  Bottom 0.203: v45.52,29.67 46.74,29.67 50.19,26.21 51.61,26.21 v52.02,26.62
ETH_LED1  (via drill 0.33)
  Top 0.203: U4.32 45.6,30.57 45.31,30.28 v44.91,30.28 | v52.02,25.4 52.43,25.81 53.4,25.81 R16.2
  Bottom 0.203: v44.91,30.28 44.91,29.26 45.11,29.06 46.74,29.06 49.99,25.81 51.61,25.81 v52.02,25.4
ETH_RXM  (via drill 0.33)
  Top 0.203: U4.12 51.25,32.47 51.82,31.9 v52.43,31.9 52.63,31.7 53.61,31.7 R21.2
  Bottom 0.203: v52.43,31.9 52.63,31.7 53.24,31.7 56.69,28.25 58.73,28.25 59.33,27.64 61.98,27.64 62.59,28.25 62.59,29.87 61.98,30.48 60.55,30.48 59.74,31.29 59.74,34.27 J1.6
ETH_RXP  (via drill 0.33)
  Top 0.203: U4.11 51.14,31.96 v51.82,31.29 53.4,31.29 R20.2
  Bottom 0.203: v51.82,31.29 53.03,31.29 56.49,27.84 58.52,27.84 59.13,27.23 62.18,27.23 62.99,28.04 62.99,30.07 61.44,31.62 J1.3
ETH_TXM  (via drill 0.33)
  Top 0.203: R19.2 53.4,34.34 v51.82,34.34 51.44,33.97 U4.15
  Bottom 0.203: v51.82,34.34 54.46,34.34 56.49,32.31 56.49,30.48 57.3,29.67 57.89,29.67 J1.2
ETH_TXP  (via drill 0.33)
  Top 0.203: U4.14 51.55,33.47 51.82,33.73 v52.43,33.73 52.63,33.93 53.61,33.93 R18.2
  Bottom 0.203: v52.43,33.73 52.63,33.93 54.25,33.93 56.08,32.11 56.08,30.28 57.1,29.26 60.76,29.26 60.94,29.08 J1.1
ETH_XI
  Top 0.203: U3.8 48.1,18.55 47.07,19.58 Y2.3 45.21,19.58 C31.1
ETH_XO
  Top 0.203: U3.7 48.6,20.55 49.92,21.88 Y2.1 51.92,21.88 C16.1
ETHA_CSN
  Top 0.203: U4.26 44.73,33.97 44.3,33.53 42.67,33.53 42.06,34.14 42.06,40.84 44.3,43.08 46.53,43.08 47.95,44.5 47.95,46.17 JP3.28
ETHA_IRQ
  Top 0.203: U4.3 47.2,29.93 46.13,28.85 44.3,28.85 40.44,32.72 40.44,41.66 43.08,44.3 43.08,46.38 JP3.24
ETHA_MISO
  Top 0.203: U4.27 44.84,33.47 44.5,33.12 42.47,33.12 41.66,33.93 41.66,41.05 44.09,43.48 45.11,43.48 46.59,44.96 JP3.25
ETHA_MOSI
  Top 0.203: U4.31 44.67,31.46 44.09,30.89 42.88,30.89 40.84,32.92 40.84,41.45 44.2,44.81 JP3.23
ETHA_RESET  (via drill 0.33)
  Top 0.203: U4.19 48.7,36.31 v48.97,36.58 | v48.97,42.27 49.28,42.57 JP3.27
  Bottom 0.203: v48.97,36.58 v48.97,42.27
ETHA_SCK
  Top 0.203: U4.28 44.95,32.97 44.7,32.72 42.27,32.72 41.25,33.73 41.25,41.25 43.89,43.89 44.7,43.89 45.52,44.7 45.52,46.28 JP3.26
ETHB_CLK
  Top 0.203: U3.16 44.86,13.36 44.3,12.8 44.3,6.83 JP2.19
ETHB_CRSDV
  Top 0.203: U3.15 44.75,13.86 43.89,13.01 43.89,7.11 42.06,5.28 41.05,5.28 40.44,4.67 40.44,2.87 JP2.20
ETHB_IRQ
  Top 0.203: U3.18 45.28,12.36 45.11,12.19 45.11,5.1 JP2.17
ETHB_MDC
  Top 0.203: U3.11 46.6,15.99 46.33,16.26 43.89,16.26 42.67,15.04 42.67,7.72 41.45,6.5 38.89,6.5 JP2.23
ETHB_MDIO
  Top 0.203: U3.10 47.1,16.1 46.53,16.66 43.69,16.66 | 43.69,16.66 42.27,15.24 42.27,7.92 41.25,6.91 37.59,6.91 35.36,4.67 35.36,2.87 JP2.24 | 43.69,16.66 42.91,17.44 R3.1
ETHB_RST
  Top 0.203: U3.24 48.6,11 47.95,10.36 47.95,5.51 JP2.13
ETHB_RXD0
  Top 0.203: 45.28,14.86 U3.13 45.08,14.86 44.91,15.04 43.89,15.04 43.48,14.63 43.48,7.32 41.86,5.69 40.62,5.69 JP2.21
ETHB_RXD1
  Top 0.203: U3.12 43.81,15.56 43.08,14.83 43.08,7.52 41.66,6.1 39.42,6.1 38,4.67 38,2.77 JP2.22
ETHB_RXER
  Top 0.203: U3.17 44.97,12.86 44.7,12.6 44.7,6.3 43.08,4.67 43.08,2.77 JP2.18
ETHB_TXD0
  Top 0.203: U3.20 46.6,11.24 45.92,10.57 45.92,5.01 JP2.15
ETHB_TXD1
  Top 0.203: U3.21 47.1,11.13 46.74,10.77 46.74,9.96 47.55,9.14 47.55,5.28 48.16,4.67 48.16,2.77 JP2.14
ETHB_TXEN
  Top 0.203: U3.19 46.1,11.35 45.52,10.77 45.52,2.87 JP2.16
ETHB_VDD
  Top 0.203: U3.1 49.41,12.36 50.39,11.38 C9.1 C8.1
FTDI_3V3  (via drill 0.33)
  Top 0.203: U$5.6 14.88,34.39 v15.24,34.75
  Bottom 0.203: v15.24,34.75 C30.1
FTDI_AVCC  (via drill 0.33)
  Top 0.203: U$5.46 15.72,36.9 v16.66,35.97
  Bottom 0.203: 16.55,36.08 v16.66,35.97
  Bottom 0.305: C32.1 R24.1 16.66,36.82 v16.66,35.97
FTDI_RESET  (via drill 0.33)
  Top 0.203: U$5.4 14.4,35.39 v14.43,35.36 | R15.2 R23.1 11.79,40.07 v11.79,39.62
  Bottom 0.203: v11.79,39.62 11.79,36.37 12.8,35.36 v14.43,35.36
FTDI_XI
  Top 0.203: U$5.43 17.23,41.41 18.42,42.6 Y4.3 20.43,42.6 C14.1
FTDI_XO
  Top 0.203: U$5.44 16.73,39.76 16.19,40.3 Y4.1 13.51,40.3 C13.1
GND  (via drill 0.33)
  Top 0.203: U4.18 49.2,33.97 v48.97,33.73 | U4.22 47.2,34.08 47.55,33.73 | U4.24 46.2,34.47 46.74,33.93 | U4.29 46.49,32.47 46.74,32.72 | U4.4 47.7,31.34 47.35,31.7 | U4.8 49.7,30.96 v48.97,31.7 | U4.13 49.42,32.97 49.17,32.72 | U3.22 47.6,12.76 47.35,13.01
  other vias: 21.74,41.45 47.96,32.72 46.94,32.72 46.94,33.73 47.96,33.73 48.97,32.72 47.96,31.7 46.94,31.7 47.35,13.61 47.35,14.43 48.16,14.43 48.16,13.61 48.16,12.8 47.35,12.8 46.53,12.8 46.53,13.61 46.53,14.43 46.74,7.52 51,12.6 52.22,14.02 38.61,26.01 24.99,26.21 23.37,24.59 27.43,26.42 27.84,31.5 27.64,33.73 8.33,40.64 13.21,43.48 24.99,36.17 28.85,39.42 28.85,38.2 31.09,36.98 29.67,28.45 38.61,39.62 51.61,28.04 47.96,26.21 52.83,29.26 54.05,28.04 52.83,35.15 54.05,39.01 54.05,40.64
  pour Bottom: -0.41,-0.41 79.04,-0.41 79.04,49.99 -0.41,49.99
  pour Top: -0.2,-0.2 78.84,-0.2 78.84,49.78 -0.2,49.78
LED_0  (via drill 0.33)
  Top 0.203: LED1.C 11.99,4.5 v11.99,5.08
  Bottom 0.203: JP2.32 25.38,0.61 14.22,0.61 11.99,2.85 v11.99,5.08
LED_1
  Top 0.203: JP2.34 22.84,0.61 14.43,0.61 12.63,2.4 LED2.C
LED_U_A  (via drill 0.33)
  Top 0.203: v13.21,30.89 13.22,30.9 U$5.12 U$5.11 | v18.69,28.65 18.9,28.45 26.42,28.45 26.62,28.65 LED3.C
  Bottom 0.203: v13.21,30.89 13.21,30.48 15.04,28.65 v18.69,28.65
LED_U_B  (via drill 0.33)
  Top 0.203: U$5.28 22.79,32.89 v22.96,32.72 22.63,32.39 U$5.27 | v22.55,30.68 23.81,29.43 LED4.C
  Bottom 0.203: v22.96,32.72 22.96,31.09 v22.55,30.68
N$1
  Top 0.305: R10.1 LED3.A
N$2
  Top 0.305: R9.1 LED4.A
N$3
  Top 0.305: U10.2 29.64,18.06 30.33,18.75 | 30.33,18.75 Y1.X1 | 30.33,18.75 30.44,18.86 C5.1
N$4  (via drill 0.33 pad 0.3)
  Top 0.305: U10.3 27.41,19.33 26.82,19.91 v26.01,19.91
  Bottom 0.305: v26.01,19.91 23.37,19.91 22.25,21.03 BAT1.VCC@1
N$5
  Top 0.305: U10.1 29.74,16.79 30.33,16.2 | 30.33,16.2 Y1.X2 | 30.33,16.2 30.44,16.09 C4.1
N$6  (via drill 0.33)
  Top 0.203: LED5.C v67.26,1.83
  Bottom 0.203: v67.26,1.83 67.26,3.45 65.23,5.49 62.79,5.49 60.35,7.92 52.67,7.92 R6.2
N$9  (via drill 0.33)
  Top 0.203: R8.1 8.9,33.33 8.13,33.33 v7.72,32.92 | JP10.D- 4.84,38.85 5.08,38.61 6.3,38.61 v6.71,39.01
  Bottom 0.203: v7.72,32.92 7.32,33.33 5.49,33.33 4.88,33.93 4.88,38 5.49,38.61 6.3,38.61 v6.71,39.01
N$10
  Bottom 0.203: C10.1 58.6,14.83 J2.4
N$11
  Bottom 0.203: C37.1 61.49,16.46 J2.5
N$12
  Top 0.203: U5.10 32.46,31.58 R25.1
N$13  (via drill 0.33)
  Top 0.203: R7.1 8.7,33.73 8.13,33.73 v7.72,34.14 | JP10.D+ 6.5,38.2 v6.71,38
  Bottom 0.203: v7.72,34.14 7.32,33.73 5.69,33.73 5.28,34.14 5.28,37.8 5.69,38.2 6.5,38.2 v6.71,38
N$14
  Top 0.203: U5.11 33.73,31.74 R26.1
N$15
  Top 0.203: U$5.2 12.58,36.39 12.19,36.78 11.82,36.78 R14.2
N$16
  Top 0.203: U7.5 15.28,24.38 R30.1
N$18
  Top 0.203: LED1.A R12.1
N$19
  Top 0.203: R11.1 LED2.A
N$20  (via drill 0.33)
  Top 0.203: R16.1 56.69,25.2 v56.9,25.4
  Bottom 0.203: v56.9,25.4 57.1,25.6 62.18,25.6 66.65,30.07 70.51,30.07 J1.10
N$21  (via drill 0.33)
  Top 0.203: R17.1 56.69,26.82 v56.9,26.62
  Bottom 0.203: v56.9,26.62 57.1,26.42 62.38,26.42 72.36,36.4 J1.11
N$22
  Top 0.203: U4.17 49.7,36.09 50.6,36.98 51.24,36.98 R2.1
N$23
  Top 0.203: U4.20 48.2,36.53 47.55,37.19 47.55,38.81 48.9,40.16 Y3.1 50.7,40.16 C17.1
N$24
  Top 0.203: U4.21 47.7,36.42 47.14,36.98 47.14,37.59 46.87,37.86 Y3.3 43.78,37.86 C18.1
N$26
  Top 0.305: C21.1 R20.1 R21.1
N$27
  Top 0.305: R18.1 R19.1 C20.1
RESET
  Top 0.203: S1.3 24.66,8 25.36,8.7 R1.1 | C1.1 R1.1 | JP2.31 26.42,6.5 26.21,6.71 R1.1
REXT
  Top 0.203: U3.9 47.6,17.06 R5.2
RSTOUT
  Top 0.203: U$5.5 12.29,34.89 R13.1
RTS_A  (via drill 0.33)
  Top 0.203: U$5.22 19.23,30.81 v19.51,31.09
  Bottom 0.203: v19.51,31.09 19.51,32.11 20.52,33.12 20.52,34.95 22.55,36.98 22.55,42.27 21.74,43.08 18.14,43.08 JP3.1
RTS_B
  Top 0.203: U$5.38 19.73,39.23 19.91,39.42 21.34,39.42 22.35,40.44 22.35,43.08 21.54,43.89 19.87,43.89 JP3.3
RX+
  Top 0.203: J2.3 62.05,13.54 62.99,12.6 62.99,9.75 61.77,8.53 56.69,8.53 51.36,13.86 U3.4
RX-
  Top 0.203: J2.6 61.49,17.35 63.4,15.44 63.4,9.55 61.98,8.13 56.49,8.13 51.25,13.36 U3.3
RX_A  (via drill 0.33)
  Top 0.203: U$5.23 19.73,29.25 20.12,28.85 20.52,28.85 20.93,29.26 v20.93,29.67
  Bottom 0.203: v20.93,29.67 20.93,31.09 21.34,31.5 21.34,34.54 23.37,36.58 23.37,42.67 22.15,43.89 20.52,43.89 20.12,44.3 20.12,46.18 JP3.4
RX_B
  Top 0.203: U$5.39 19.23,37.67 19.51,37.39 20.52,37.39 23.16,40.03 23.16,44.24 JP3.7
SCL  (via drill 0.33 pad 0.3)
  Top 0.203: v25.6,17.48 25.6,17.88 24.18,19.3 23.01,19.3 U10.6 | U2.4 33.26,12.13 32.92,11.79 32.51,11.79 31.7,12.6 v30.07,12.6 29.67,12.19 R4.2
  Bottom 0.203: v25.6,17.48 30.07,13.01 v30.07,12.6 30.07,7.32 31.5,5.89 JP2.27
SD_DET
  Top 0.203: JP2.33 23.88,5.99 16.87,13.01 16.87,17.07 15.5,18.43 U1.CD1
SDA  (via drill 0.33 pad 0.3)
  Top 0.203: v26.21,18.09 26.01,18.09 24.59,19.51 24.59,20.32 24.31,20.6 U10.5 | U2.5 33.12,11.18 32.92,11.38 32.31,11.38 31.5,12.19 30.89,12.19 v30.68,11.99 31.09,11.58 R22.2
  Bottom 0.203: v26.21,18.09 26.21,17.48 30.68,13.01 v30.68,11.99 30.48,11.79 30.48,7.52 32.72,5.28 32.72,2.87 JP2.28
T1
  Top 0.203: U2.3 36.66,12.48 37.02,12.84 C2.1 38.04,12.8 TP1.TP
TX+
  Top 0.203: J2.1 61.11,10.11 60.76,9.75 58.12,9.75 52.83,15.04 52.63,15.04 52.22,15.04 51.61,15.04 51.44,14.86 U3.6
TX-
  Top 0.203: U3.5 51.55,14.36 51.82,14.63 52.63,14.63 57.91,9.35 61.37,9.35 62.18,10.16 62.18,11.79 61.98,11.99 58.85,11.99 J2.2
TX_A  (via drill 0.33)
  Top 0.203: U$5.24 20.23,30.39 20.32,30.48 v21.54,30.48
  Bottom 0.203: v21.54,30.48 21.54,31.09 21.74,31.29 21.74,34.34 23.77,36.37 23.77,42.88 22.55,44.09 22.55,46.28 JP3.6
TX_B
  Top 0.203: U$5.40 18.73,37.56 19.3,36.98 20.73,36.98 23.57,39.83 23.57,43.08 25.45,44.96 JP3.9
USB_DM
  Top 0.203: U$5.8 11.48,33.39 R8.2
USB_DP
  Top 0.203: U$5.7 11.46,33.89 R7.2 11.01,34.47 R13.2
USB_POWER
  Top 0.406: JP10.VBUS 5.16,39.5 7.72,42.06 R15.1 9.51,45.76 JP1.1
USBA_DM
  Top 0.203: R25.2 32.55,29.8 R27.1 32.92,28.08 32.92,26.21 32.51,25.81 27.03,25.81 25.6,27.23 10.36,27.23 9.92,27.68 5.32,27.68 5.12,27.47 JP6.D-
USBA_DP
  Top 0.203: JP6.D+ 5.08,26.82 5.49,27.23 9.75,27.23 10.16,26.82 25.4,26.82 26.82,25.4 32.72,25.4 33.33,26.01 33.33,26.45 R28.1 R29.2 33.93,28.48 R26.2
USBA_EN  (via drill 0.33)
  Top 0.203: U7.3 21,25.33 22.76,23.57 37.19,23.57 39.22,25.6 v39.22,26.62
  Bottom 0.203: v39.22,26.62 38.41,27.43 38.41,36.78 40.44,38.81 40.44,46.18 JP3.20
USBA_FAULT  (via drill 0.33)
  Top 0.203: U7.4 16.8,25.33 17.48,26.01 20.93,26.01 22.96,23.98 36.78,23.98 38,25.2 v38,26.62
  Bottom 0.203: v38,26.62 38,36.98 40.03,39.01 40.03,44.05 JP3.19
USBA_ID  (via drill 0.33)
  Top 0.203: JP6.ID 5.32,26.17 5.69,25.81 8.13,25.81 v8.53,26.21
  Bottom 0.203: v8.53,26.21 8.94,25.81 23.98,25.81 26.01,23.77 37.59,23.77 39.83,26.01 39.83,27.03 38.81,28.04 38.81,36.58 40.84,38.61 40.84,44.14 JP3.21
USBA_OE
  Top 0.203: U5.2 36.27,40.13 35.36,41.05 33.73,41.05 32.72,42.06 32.72,46.28 JP3.14
USBA_PD  (via drill 0.33)
  Top 0.203: R28.2 36.58,28 v36.58,29.26
  Bottom 0.203: v36.58,29.26 36.58,29.87 36.98,30.28 36.98,38.81 37.8,39.62 37.8,46.28 JP3.18
USBA_POWER  (via drill 0.33)
  Top 0.203: JP5.1 8.13,24.38 R31.1
  Top 0.406: JP6.VBUS 4.02,28.81 v4.47,29.26
  Top 0.61: U7.6 16.32,23.43 14.43,21.54 10.97,21.54 JP5.1
  Bottom 0.61: v4.47,29.26 2.23,29.26 1.83,28.85 1.83,25.81 4.47,23.16 JP5.1
USBA_PU  (via drill 0.33)
  Top 0.203: R29.1 35.6,29.5 v35.97,29.87
  Bottom 0.203: JP3.17 37.39,44.15 37.39,39.83 36.58,39.01 36.58,30.48 v35.97,29.87
USBA_SPEED  (via drill 0.33)
  Top 0.203: U5.9 31.19,35.05 29.67,36.58 28.25,36.58 26.42,38.41 v26.42,41.66
  Bottom 0.203: JP3.8 25.2,46.18 25.2,42.88 v26.42,41.66
USBA_VM  (via drill 0.33)
  Top 0.203: U5.5 32.46,39.67 31.29,40.84 v28.25,40.84
  Bottom 0.203: JP3.10 27.64,46.28 27.64,41.45 v28.25,40.84
USBA_VMO  (via drill 0.33)
  Top 0.203: U5.13 36.27,34.85 v35.76,35.36
  Bottom 0.203: v35.76,35.36 35.15,35.97 35.15,46.39 JP3.16
USBA_VP
  Top 0.203: U5.4 33.73,40.44 32.31,41.86 32.31,44.15 JP3.13
USBA_VPO  (via drill 0.33)
  Top 0.203: U5.12 35,35.1 v34.75,35.36
  Bottom 0.203: v34.75,35.36 34.75,44.25 JP3.15
USBA_VSENSE  (via drill 0.33)
  Top 0.203: R32.1 R31.2 5.28,24.38 6.3,25.4 8.13,25.4 v8.53,24.99
  Bottom 0.203: v8.53,24.99 8.94,25.4 23.77,25.4 25.81,23.37 37.8,23.37 40.23,25.81 40.23,27.23 39.22,28.25 39.22,36.37 41.25,38.41 41.25,42.88 42.88,44.5 42.88,46.28 JP3.22

### Text on the board
_tsilk: ETH_A | UART | B | A | USB / OTG | de0_orpsoc rev1 / #openrisc @freenode | Reset | FB2014 | ETH_B | A | B